# EAGLE design hw2_sch (EAGLE 8.7.1)
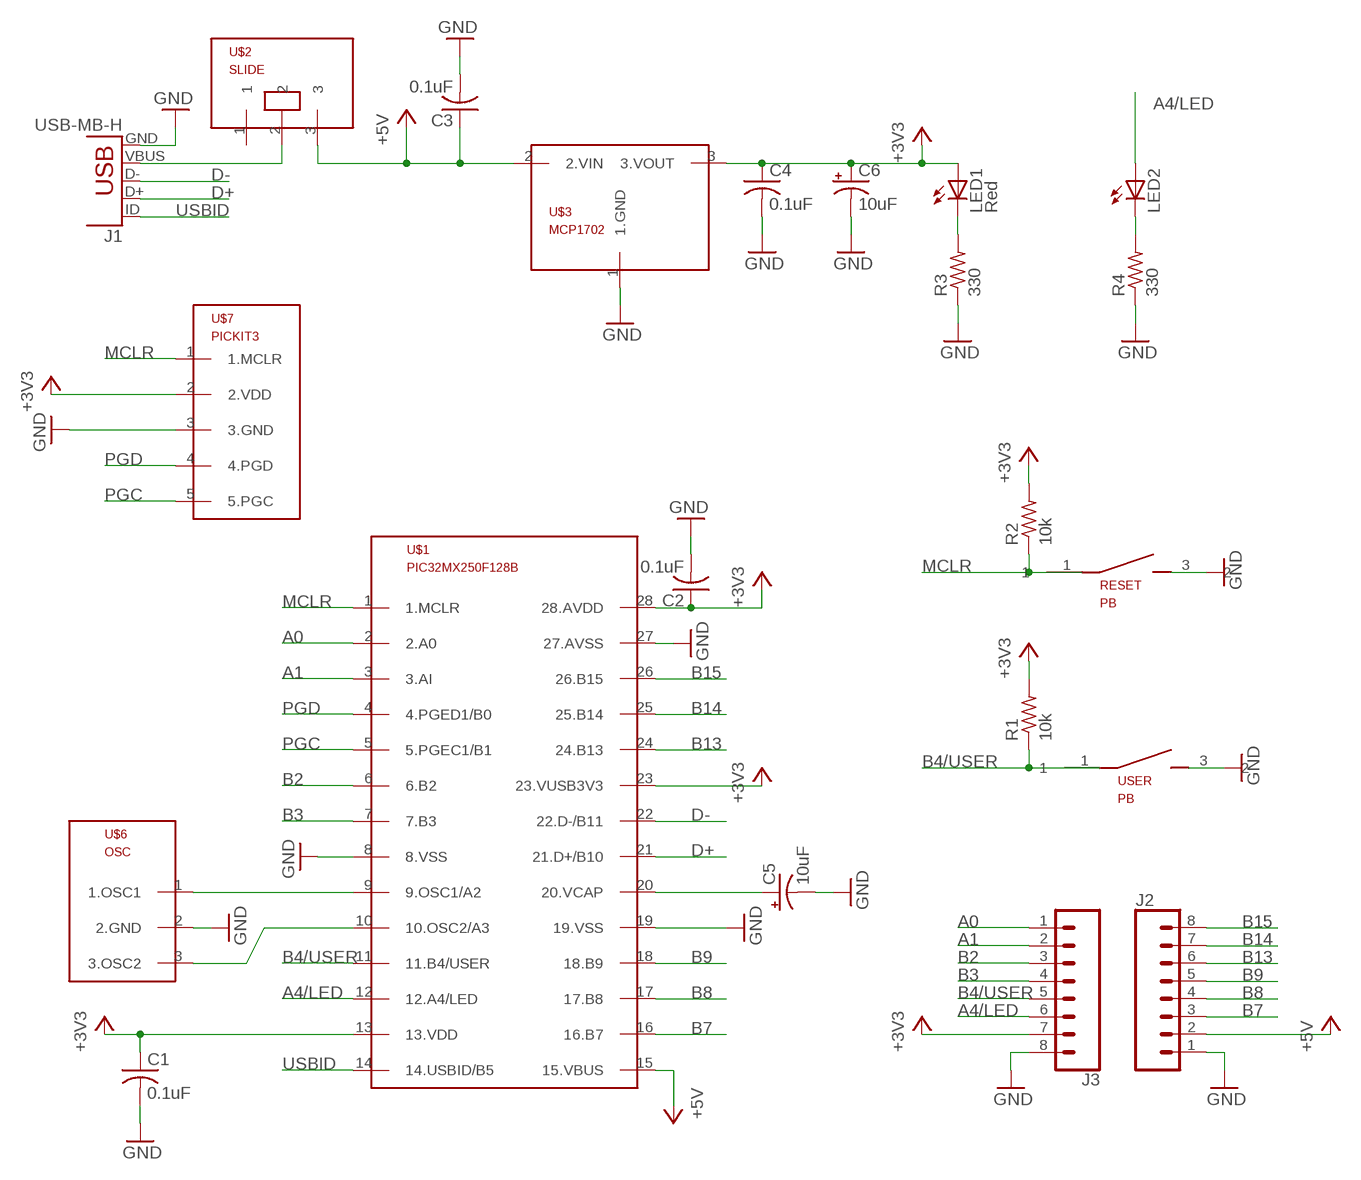
[diagram p0: schematic, sheet 1]

## Parts
C1  0.1uF  C-US025-025X050  [C025-025X050]
C2  0.1uF  C-US025-025X050  [C025-025X050]
C3  0.1uF  C-US025-025X050  [C025-025X050]
C4  0.1uF  C-US025-025X050  [C025-025X050]
C5  10uF  CPOL-USB45181B  [B45181B]
C6  10uF  CPOL-USB45181B  [B45181B]
J1  USB-MB-H  [USB-MB-H]
J2  CONN_08"  [1X08]
J3  CONN_08"  [1X08]
LED1  Red  LED3MM  [LED3MM]
LED2  LED3MM  [LED3MM]
R1  10k  R-US_0207/10  [0207/10]
R2  10k  R-US_0207/10  [0207/10]
R3  330  R-US_0207/10  [0207/10]
R4  330  R-US_0207/10  [0207/10]
RESET  PB  [PB]
U$1  PIC32MX250F128B  [DIL28-3]
U$2  SLIDE  [SLIDE]
U$3  MCP1702  [TO92]
U$6  OSC  [OSC]
U$7  PICKIT3  [1X05]
USER  PB  [PB]

## Nets
+3V3: C1.1 C2.1 C4.1 C6.+ J3.7 LED1.A R1.2 R2.2 U$1.13(13.VDD) U$1.23(23.VUSB3V3) U$1.28(28.AVDD) U$3.3(3.VOUT) U$7.2(2.VDD)
+5V: C3.1 J2.2 U$1.15(15.VBUS) U$2.3 U$3.2(2.VIN)
A0: J3.1 U$1.2(2.A0)
A1: J3.2 U$1.3(3.AI)
A4/LED: J3.6 LED2.A U$1.12(12.A4/LED)
B2: J3.3 U$1.6(6.B2)
B3: J3.4 U$1.7(7.B3)
B4/USER: J3.5 R1.1 U$1.11(11.B4/USER) USER.1
B7: J2.3 U$1.16(16.B7)
B8: J2.4 U$1.17(17.B8)
B9: J2.5 U$1.18(18.B9)
B13: J2.6 U$1.24(24.B13)
B14: J2.7 U$1.25(25.B14)
B15: J2.8 U$1.26(26.B15)
D+: J1.D+ U$1.21(21.D+/B10)
D-: J1.D- U$1.22(22.D-/B11)
GND: C1.2 C2.2 C3.2 C4.2 C5.- C6.- J1.GND J2.1 J3.8 R3.1 R4.1 RESET.3 U$1.8(8.VSS) U$1.19(19.VSS) U$1.27(27.AVSS) U$3.1(1.GND) U$6.2(2.GND) U$7.3(3.GND) USER.3
MCLR: R2.1 RESET.1 U$1.1(1.MCLR) U$7.1(1.MCLR)
N$1: J1.VBUS U$2.2
N$2: U$1.9(9.OSC1/A2) U$6.1(1.OSC1)
N$3: LED1.K(C) R3.2
N$4: U$1.10(10.OSC2/A3) U$6.3(3.OSC2)
N$5: C5.+ U$1.20(20.VCAP)
N$7: LED2.K(C) R4.2
PGC: U$1.5(5.PGEC1/B1) U$7.5(5.PGC)
PGD: U$1.4(4.PGED1/B0) U$7.4(4.PGD)
USBID: J1.ID U$1.14(14.USBID/B5)
Unconnected: U$2.1

## Library data of the parts
C1-C4 = PIC32_hw2:C-US: CAPACITOR, American symbol
C5 C6 = PIC32_hw2:CPOL-US: POLARIZED CAPACITOR, American symbol
J1 = PIC32_hw2:USB: USB Connectors USB-B-PTH is fully proven SKU : PRT-00139/CONN-08278 USB-miniB is fully proven SKU : PRT-00587 USB-A-PCB is untested. USB-A-H is throughly reviewed, but untested. Spark Fun Electronics SKU : PRT-00437 USB-B-SMT is throughly reviewed, but untested. Needs silkscreen touching up. USB-A-S has not been used/tested USB-MB-H has not been used/tested USB-MICROB has been used. CONN-09505
J2 J3 = PIC32_hw2:CONN_08: Multi connection point. Often used as Generic Header-pin footprint for 0.1 inch spaced/style header connections On any of the 0.1 inch spaced packages, you can populate with these: Break Away Headers - Straight <https://www.sparkfun.com/products/116> (PRT-00116) Break Away Male Headers - Right Angle <https://www.sparkfun.com/products/553> (PRT-00553) Female Headers <https://www.sparkfun.com/products/115> (PRT-00115) Break Away Headers - Machine Pin <https://www.sparkfun.com/products/117> (PRT-00117) Break Away Female Headers - Swiss Machine Pin <https://www.sparkfun.com/products/743> (PRT-00743) Arduino Stackable Header - 8 Pin <https://www.sparkfun.com/products/9279> (PRT-09279) For SCREWTERMINALS and SPRING TERMINALS visit here: Screw Terimnals on SparkFun.com <https://www.sparkfun.com/search/results?term=Screw+Terminals> (5mm/3.5mm/2.54mm spacing) This device is also useful as a general connection point to wire up your design to another part of your project. Our various solder wires solder well into these plated through hole pads. Hook-Up Wire - Assortment (Stranded, 22 AWG) <https://www.sparkfun.com/products/11375> (PRT-11375) Hook-Up Wire - Assortment (Solid Core, 22 AWG) <https://www.sparkfun.com/products/11367> (PRT-11367) View the entire wire category on our website here <https://www.sparkfun.com/categories/141> Special notes: Molex polarized connector foot print use with SKU : PRT-08231 with associated crimp pins and housings. 1MM SMD Version SKU: PRT-10208 NOTES ON THE VARIANTS LOCK and LOCK_LONGPADS... This footprint was designed to help hold the alignment of a through-hole component (i.e. 6-pin header) while soldering it into place. You may notice that each hole has been shifted either up or down by 0.005 of an inch from it's more standard position (which is a perfectly straight line). This slight alteration caused the pins (the squares in the middle) to touch the edges of the holes. Because they are alternating, it causes a "brace" to hold the component in place. 0.005 has proven to be the perfect amount of "off-center" position when using our standard breakaway headers. Although looks a little odd when you look at the bare footprint, once you have a header in there, the alteration is very hard to notice. Also,if you push a header all the way into place, it is covered up entirely on the bottom side.; PROD_ID: CONN-08438
LED1 LED2 = led:LED: LED OSRAM: - CHIPLED LG R971, LG N971, LY N971, LG Q971, LY Q971, LO R971, LY R971 LH N974, LH R974 LS Q976, LO Q976, LY Q976 LO Q996 - Hyper CHIPLED LW Q18S LB Q993, LB Q99A, LB R99A - SideLED LS A670, LO A670, LY A670, LG A670, LP A670 LB A673, LV A673, LT A673, LW A673 LH A674 LY A675 LS A676, LA A676, LO A676, LY A676, LW A676 LS A679, LY A679, LG A679 - Hyper Micro SIDELED® LS Y876, LA Y876, LO Y876, LY Y876 LT Y87S - SmartLED LW L88C, LW L88S LB L89C, LB L89S, LG L890 LS L89K, LO L89K, LY L89K LS L896, LA L896, LO L896, LY L896 - TOPLED LS T670, LO T670, LY T670, LG T670, LP T670 LSG T670, LSP T670, LSY T670, LOP T670, LYG T670 LG T671, LOG T671, LSG T671 LB T673, LV T673, LT T673, LW T673 LH T674 LS T676, LA T676, LO T676, LY T676, LB T676, LH T676, LSB T676, LW T676 LB T67C, LV T67C, LT T67C, LS T67K, LO T67K, LY T67K, LW E67C LS E67B, LA E67B, LO E67B, LY E67B, LB E67C, LV E67C, LT E67C LW T67C LS T679, LY T679, LG T679 LS T770, LO T770, LY T770, LG T770, LP T770 LB T773, LV T773, LT T773, LW T773 LH T774 LS E675, LA E675, LY E675, LS T675 LS T776, LA T776, LO T776, LY T776, LB T776 LHGB T686 LT T68C, LB T68C - Hyper Mini TOPLED® LB M676 - Mini TOPLED Santana® LG M470 LS M47K, LO M47K, LY M47K Source: http://www.osram.convergy.de LUXEON: - LUMILED® LXK2-PW12-R00, LXK2-PW12-S00, LXK2-PW14-U00, LXK2-PW14-V00 LXK2-PM12-R00, LXK2-PM12-S00, LXK2-PM14-U00 LXK2-PE12-Q00, LXK2-PE12-R00, LXK2-PE12-S00, LXK2-PE14-T00, LXK2-PE14-U00 LXK2-PB12-K00, LXK2-PB12-L00, LXK2-PB12-M00, LXK2-PB14-N00, LXK2-PB14-P00, LXK2-PB14-Q00 LXK2-PR12-L00, LXK2-PR12-M00, LXK2-PR14-Q00, LXK2-PR14-R00 LXK2-PD12-Q00, LXK2-PD12-R00, LXK2-PD12-S00 LXK2-PH12-R00, LXK2-PH12-S00 LXK2-PL12-P00, LXK2-PL12-Q00, LXK2-PL12-R00 Source: www.luxeon.com KINGBRIGHT: KA-3528ASYC Source: www.kingbright.com
R1-R4 = PIC32_hw2:R-US_: RESISTOR, American symbol
RESET USER = PIC32_hw2:PB
U$1 = PIC32_hw2:PIC32MX250F128B
U$2 = PIC32_hw2:SLIDE
U$3 = PIC32_hw2:MCP1702
U$6 = PIC32_hw2:OSC
U$7 = PIC32_hw2:PICKIT3

## Board
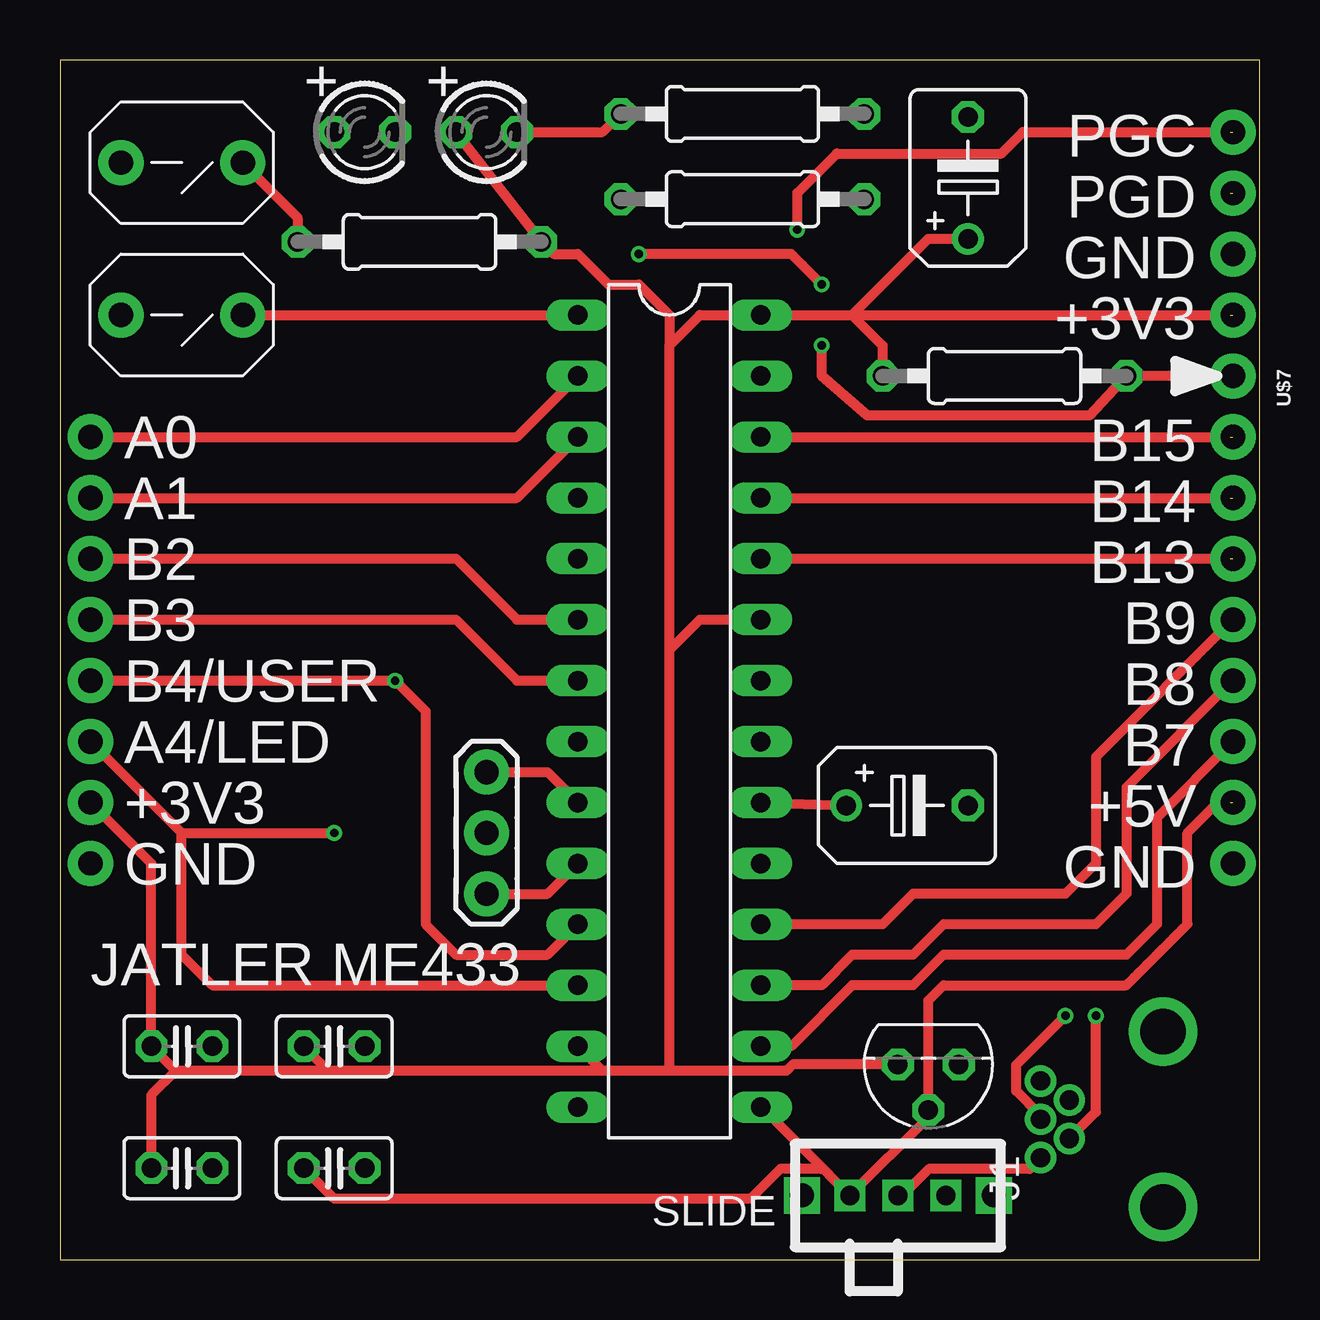
[diagram p1: board, top side]
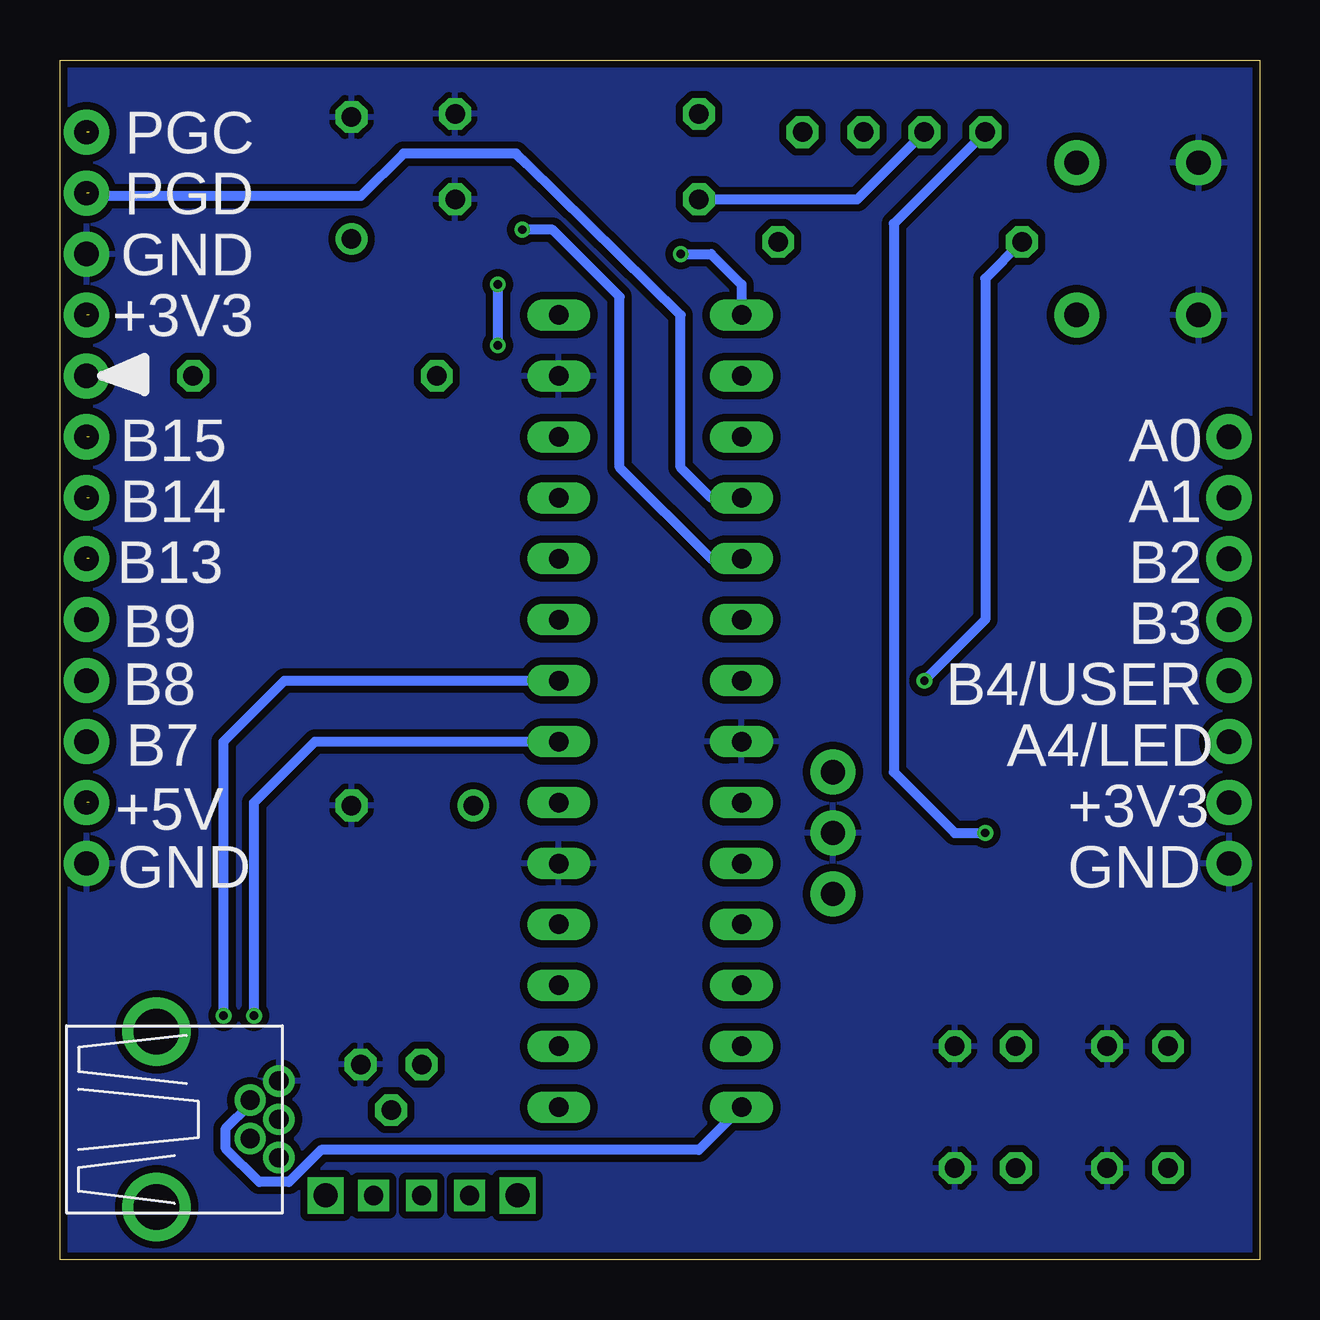
[diagram p2: board, bottom side, seen from below]

Size 50 x 50 mm. Coordinates in mm from the lower left corner, seen from the top.
Outline: 0,0 50,0 50,50 0,50 0,0
Copper layers (1*16): Top 0.035mm / dielectric 1.5mm / Bottom 0.035mm
Design rules "SeeedStudio_2layer_DRU_no_angle_20140221": minimum track width 6mil, minimum drill 12mil, track to track 6mil, track to pad 6mil, pad to pad 6mil, via to via 6mil, smd to smd 0mil, copper to edge 10mil, drill to drill 10mil, minimum pad ring 10mil, minimum via ring 6mil, stop-mask expansion 2mil, vias tented up to drill 100mil, thermal gap 10mil

### Footprints (pad centres in the part's own frame; a part is rotated, then mirrored left to right if it is on the bottom)
C025-025X050 = drill 0.813 octagon: 1 -1.27,0; 2 1.27,0
B45181B = drill 0.813: + -2.54,0 | drill 0.813 octagon: - 2.54,0
USB-MB-H = drill 0.8: D+ 5.1,0; D- 3.9,0.8; GND 5.1,-1.6; ID 3.9,-0.8; VBUS 5.1,1.6 | drill 1.9: P$6 0,-3.65; P$7 0,3.65
1X08 = drill 1.016 pad 1.88: 1 0,0; 2 2.54,0; 3 5.08,0; 4 7.62,0; 5 10.16,0; 6 12.7,0; 7 15.24,0; 8 17.78,0
LED3MM = drill 0.813 octagon: A -1.27,0; K 1.27,0
0207/10 = drill 0.813 octagon: 1 -5.08,0; 2 5.08,0
PB = drill 1.016 pad 1.88: 1 -2.54,0; 3 2.54,0
DIL28-3 = drill 0.813 long: 1 -16.51,-3.81; 2 -13.97,-3.81; 3 -11.43,-3.81; 4 -8.89,-3.81; 5 -6.35,-3.81; 6 -3.81,-3.81; 7 -1.27,-3.81; 8 1.27,-3.81; 9 3.81,-3.81; 10 6.35,-3.81; 11 8.89,-3.81; 12 11.43,-3.81; 13 13.97,-3.81; 14 16.51,-3.81; 15 16.51,3.81; 16 13.97,3.81; 17 11.43,3.81; 18 8.89,3.81; 19 6.35,3.81; 20 3.81,3.81; 21 1.27,3.81; 22 -1.27,3.81; 23 -3.81,3.81; 24 -6.35,3.81; 25 -8.89,3.81; 26 -11.43,3.81; 27 -13.97,3.81; 28 -16.51,3.81
SLIDE = drill 0.8 square: 1 -2,0; 2 0,0; 3 2,0 | drill 1 square: P$1 -4,0; P$2 4,0
TO92 = drill 0.813 octagon: 1 -1.27,0; 2 0,1.905; 3 1.27,0
OSC = drill 1.016 pad 1.88: 1 -2.54,0; 2 0,0; 3 2.54,0
1X05 = drill 1.016 pad 1.88: 1 0,0; 2 2.54,0; 3 5.08,0; 4 7.62,0; 5 10.16,0

### Placement (x,y rotation side)
C1  5.08,8.89 0 top
C2  11.43,8.89 0 top
C3  11.43,3.81 0 top
C4  5.08,3.81 0 top
C5  35.31,18.92 0 top
C6  37.85,45.09 90 top
J1  45.97,5.84 180 top
J2  48.9,16.51 90 top
J3  1.27,34.29 270 top
LED1  17.78,46.99 0 top
LED2  12.7,46.99 0 top
R1  14.99,42.42 0 top
R2  39.37,36.83 180 top
R3  28.45,47.75 180 top
R4  28.45,44.2 180 top
RESET  5.08,39.37 180 top
U$1  25.4,22.86 270 top
U$2  34.92,2.67 180 top
U$3  36.2,8.13 180 top
U$6  17.78,17.78 270 top
U$7  48.9,36.83 90 top
USER  5.08,45.72 180 top

### Tracks (layer width: path | path; a pad name or v marks a point on that pad's centre or on a via)
+3V3  (1 unrouted)
  Top 0.406: U$3.3 30.55,8.13 30.29,7.87 25.4,7.87 | 25.4,7.87 22.61,7.87 | 22.61,7.87 U$1.13 | 25.4,25.4 26.67,26.67 U$1.23 | 25.4,7.87 25.4,25.4 | 25.4,38.1 26.67,39.37 U$1.28 33.02,39.37 | 25.4,25.4 25.4,38.1 | LED1.A R1.2 20.57,41.91 21.59,41.91 22.86,40.64 24.13,40.64 25.4,39.37 25.4,38.1 | 33.02,39.37 48.78,39.37 | 33.02,39.37 34.29,38.1 R2.2 | 11.18,7.87 C2.1 | 22.61,7.87 11.18,7.87 | 11.18,7.87 4.83,7.87 | 4.83,7.87 C1.1 3.81,16.51 J3.7 | 4.83,7.87 3.81,6.86 C4.1 | 33.02,39.37 36.2,42.55 C6.+
+5V  (1 unrouted)
  Top 0.406: 48.78,19.05 48.26,19.05 46.99,17.78 46.99,13.97 44.45,11.43 36.83,11.43 36.2,10.79 U$3.2 36.2,5.94 U$2.3 32.03,3.56 32.03,3.57 31.77,3.83 | 31.77,3.83 29.25,6.35 U$1.15 | 31.77,3.83 31.72,3.78 30.02,3.78 28.79,2.54 11.43,2.54 C3.1
A0
  Top 0.406: J3.1 19.05,34.29 U$1.2
A1
  Top 0.406: U$1.3 19.05,31.75 J3.2
A4/LED  (via drill 0.35)
  Top 0.406: U$1.12 6.35,11.43 5.08,12.7 5.08,17.78 | 5.08,17.78 J3.6 | 5.08,17.78 v11.43,17.78
  Bottom 0.406: LED2.A 15.24,43.18 15.24,20.32 12.7,17.78 v11.43,17.78
B2
  Top 0.406: J3.3 16.51,29.21 19.05,26.67 U$1.6
B3
  Top 0.406: J3.4 16.51,26.67 19.05,24.13 U$1.7
B4/USER  (via drill 0.35)
  Top 0.406: U$1.11 20.32,12.7 16.51,12.7 15.24,13.97 15.24,22.86 v13.97,24.13 J3.5 | USER.1 9.91,43.43 R1.1
  Bottom 0.406: R1.1 11.43,40.89 11.43,26.67 v13.97,24.13
B7
  Top 0.406: J2.3 45.72,18.41 45.72,13.97 44.45,12.7 36.83,12.7 35.56,11.43 33.02,11.43 30.48,8.89 U$1.16
B8
  Top 0.406: J2.4 44.45,19.68 44.45,15.24 43.18,13.97 36.83,13.97 35.56,12.7 33.02,12.7 31.75,11.43 U$1.17
B9
  Top 0.406: J2.5 43.18,20.95 43.18,16.51 41.91,15.24 35.56,15.24 34.29,13.97 U$1.18
B13  (1 unrouted)
  Top 0.406: U$1.24 48.78,29.21
B14  (1 unrouted)
  Top 0.406: U$1.25 48.78,31.75
B15  (1 unrouted)
  Top 0.406: U$1.26 48.78,34.29
D+  (via drill 0.35)
  Top 0.406: J1.D+ 40.87,6.01 39.86,7.02 39.86,8.11 v41.91,10.16
  Bottom 0.406: v41.91,10.16 41.91,19.05 39.37,21.59 U$1.21
D-  (via drill 0.35)
  Top 0.406: J1.D- 43.18,6.15 v43.18,10.16
  Bottom 0.406: v43.18,10.16 43.18,21.59 40.64,24.13 U$1.22
GND
  pour Bottom (isolate 0.305): 0,50.8 50.8,50.8 50.8,-1.27 -1.27,-1.27 -1.27,50.8
MCLR  (via drill 0.35)
  Top 0.406: RESET.1 U$1.1 | U$7.1 R2.1 42.93,35.18 33.66,35.18 31.75,36.83 v31.75,38.1 | v31.75,40.64 30.48,41.91 v24.13,41.91
  Bottom 0.406: v31.75,38.1 v31.75,40.64 | v24.13,41.91 22.86,41.91 21.59,40.64 U$1.1
N$1
  Top 0.406: J1.VBUS 40.41,3.78 36.22,3.78 35.11,2.67 U$2.2
N$2
  Top 0.406: U$6.1 20.32,20.32 U$1.9
N$3
  Top 0.406: LED1.K 22.61,46.99 R3.2
N$4
  Top 0.406: U$6.3 20.32,15.24 U$1.10
N$5
  Top 0.406: U$1.20 C5.+
N$7
  Bottom 0.406: R4.2 16.76,44.2 LED2.K
PGC  (via drill 0.35)  (1 unrouted)
  Top 0.406: v30.73,42.93 30.73,44.45 32.38,46.1 39.24,46.1 40.13,46.99 48.78,46.99
  Bottom 0.406: U$1.5 22.86,29.21 26.67,33.02 26.67,40.13 29.46,42.93 v30.73,42.93
PGD  (1 unrouted)
  Bottom 0.406: U$1.4 22.86,31.75 24.13,33.02 24.13,39.37 30.54,45.66 | 30.54,45.66 30.99,46.1 | 30.54,45.66 30.98,46.1 35.69,46.1 37.47,44.32 48.77,44.32 48.78,44.34 48.78,44.45
USBID
  Bottom 0.406: U$1.14 23.37,4.57 39.12,4.57 40.46,3.23 41.69,3.23 43.08,4.62 43.08,5.46 42.07,6.47 J1.ID

### Text on the board
tPlace: + | + | PGC | PGD | GND | +3V3 | B15 | A0 | B14 | A1 | B13 | B2 | B9 | B3 | B8 | B4/USER | B7 | A4/LED | +5V | +3V3 | GND | GND | JATLER ME433
bPlace: PGC | PGD | GND | +3V3 | B15 | A0 | B14 | A1 | B13 | B2 | B9 | B3 | B8 | B4/USER | B7 | A4/LED | +5V | +3V3 | GND | GND
200bmp: /Users/jatler/GitHub/jatler_ME433_2018/HW3/logo_v2.bmp